# EAGLE design 32u4_Science_Rev_A (EAGLE 6.5.0)
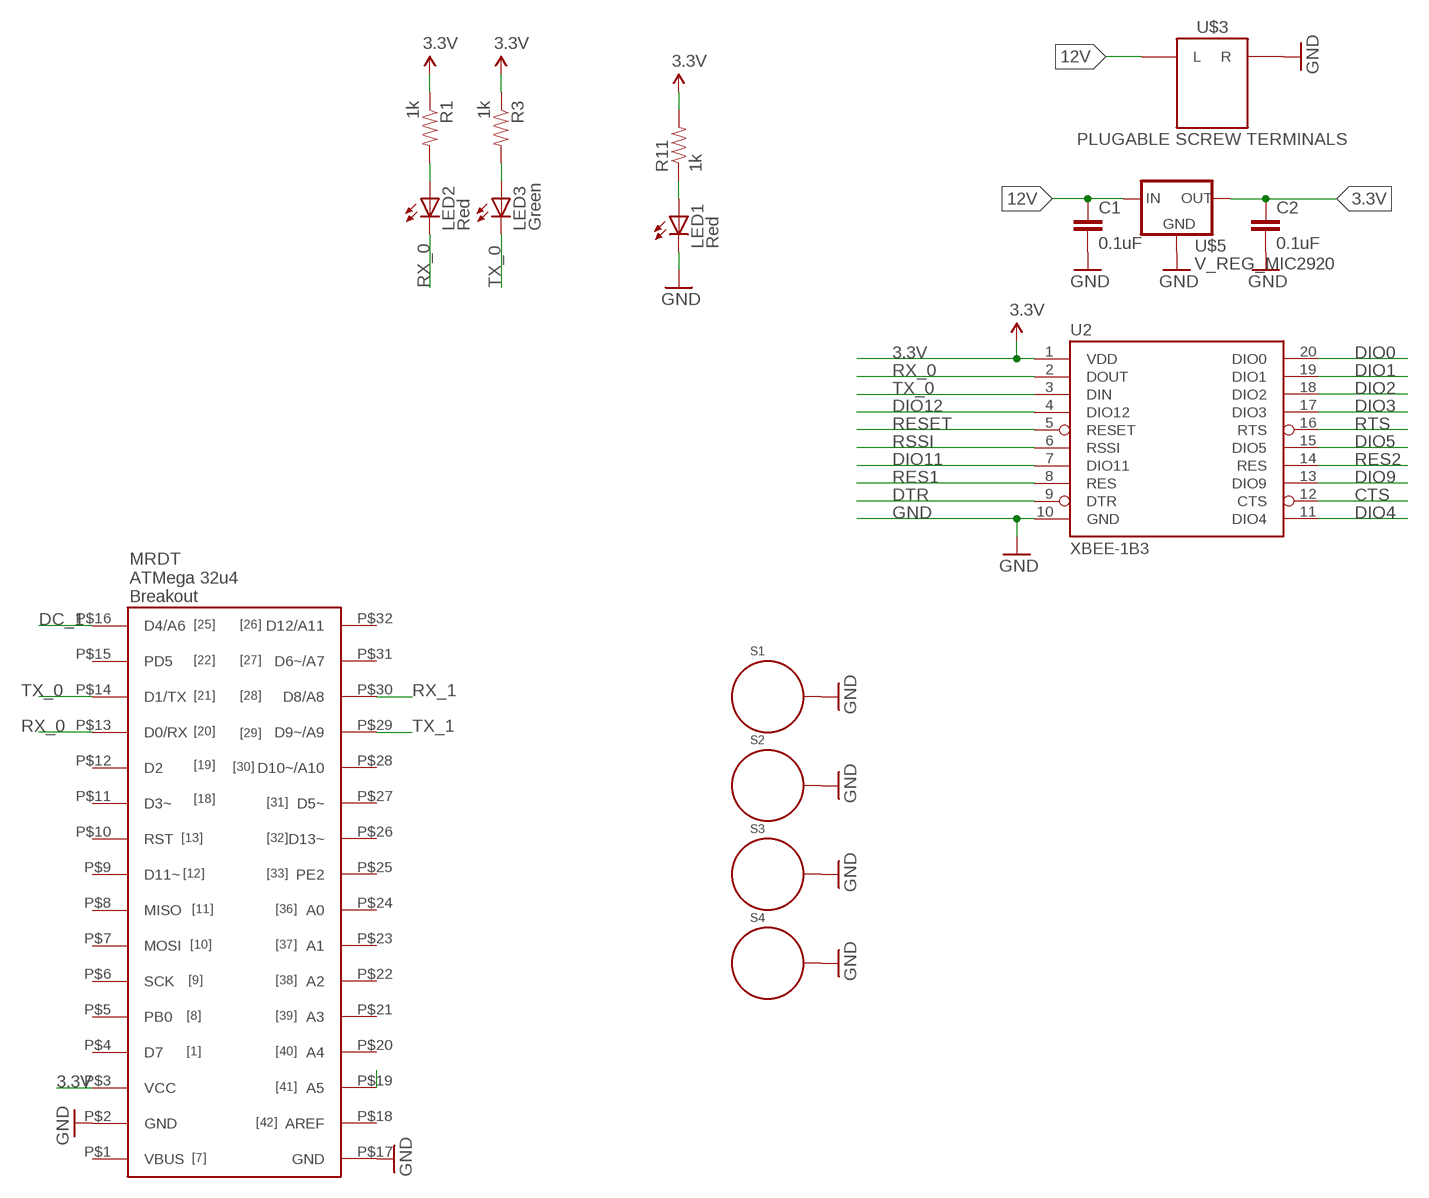
[diagram p0: schematic, sheet 1]

## Parts
C1  0.1uF  CAP1206  [1206]
C2  0.1uF  CAP1206  [1206]
LED1  Red  LED0603  [LED-0603]
LED2  Red  LED0603  [LED-0603]
LED3  Green  LED0603  [LED-0603]
R1  1k  RESISTOR1206  [1206]
R3  1k  RESISTOR1206  [1206]
R11  1k  RESISTOR1206  [1206]
S1  STANDOFF_ELECTRICAL  [STANDOFF-ELECTRICAL]
S2  STANDOFF_ELECTRICAL  [STANDOFF-ELECTRICAL]
S3  STANDOFF_ELECTRICAL  [STANDOFF-ELECTRICAL]
S4  STANDOFF_ELECTRICAL  [STANDOFF-ELECTRICAL]
U2  XBEE-1B3  [XBEE-SMD]
U$1  32U4_BREAKOU_SMD  [32U3_MCU_DIP_SMD]
U$3  PLUGABLE SCREW TERMINALS  H_WR-TBL_3210002VERT  [691321100002]
U$5  V_REG_MIC2920  [SOT223]

## Nets
3.3V [vcc]: C2.1 R1.1 R3.1 R11.2 U2.1(VDD) U$1.P$3(VCC) U$5.3(OUT)
12V: C1.1 U$3.L U$5.1(IN)
CTS: U2.12(CTS)
DC_1: U$1.P$16(D4/A6)
DIO0: U2.20(DIO0)
DIO1: U2.19(DIO1)
DIO2: U2.18(DIO2)
DIO3: U2.17(DIO3)
DIO4: U2.11(DIO4)
DIO5: U2.15(DIO5)
DIO9: U2.13(DIO9)
DIO11: U2.7(DIO11)
DIO12: U2.4(DIO12)
DTR: U2.9(DTR)
GND: C1.2 C2.2 LED1.C S1.P1 S2.P1 S3.P1 S4.P1 U2.10(GND) U$1.P$2(GND) U$1.P$17(GND) U$3.R U$5.2(GND) U$5.4(GND)
N$1: LED2.A R1.2
N$4: LED3.A R3.2
N$11: U$1.P$19(A5)
N$38: LED1.A R11.1
RES1: U2.8(RES)
RES2: U2.14(RES)
RESET: U2.5(RESET)
RSSI: U2.6(RSSI)
RTS: U2.16(RTS)
RX_0: LED2.C U2.2(DOUT) U$1.P$13(D0/RX)
RX_1: U$1.P$30(D8/A8)
TX_0: LED3.C U2.3(DIN) U$1.P$14(D1/TX)
TX_1: U$1.P$29(D9~/A9)
Unconnected: U$1.P$1(VBUS) U$1.P$4(D7) U$1.P$5(PB0) U$1.P$6(SCK) U$1.P$7(MOSI) U$1.P$8(MISO) U$1.P$9(D11~) U$1.P$10(RST) U$1.P$11(D3~) U$1.P$12(D2) U$1.P$15(PD5) U$1.P$18(AREF) U$1.P$20(A4) U$1.P$21(A3) U$1.P$22(A2) U$1.P$23(A1) U$1.P$24(A0) U$1.P$25(PE2) U$1.P$26(D13~) U$1.P$27(D5~) U$1.P$28(D10~/A10) U$1.P$31(D6~/A7) U$1.P$32(D12/A11)

## Library data of the parts
C1 C2 = SparkFun-Passives:CAP: Capacitor Standard 0603 ceramic capacitor, and 0.1" leaded capacitor.
LED1-LED3 = SparkFun:LED: LEDs Standard schematic elements and footprints for 5mm, 3mm, 1206, and 0603 sized LEDs. 5mm - Spark Fun Electronics SKU : COM-00529 (and others)
R1 R3 R11 = SparkFun-Passives:RESISTOR: Resistor Basic schematic elements and footprints for 0603, 1206, and PTH resistors.
S1-S4 = SparkFun-Electromechanical:STANDOFF_ELECTRICAL: A standoff intended to be an electrically connected point. Pad size and stop size allow for a #4 Phillips pan screw head to make a solid connection to the board.
U2 = SparkFun:XBEE-1
U$1 = MRDT-2015-General:32U4_BREAKOU_SMD
U$3 = MRDT-2015-PowerBoard:H_WR-TBL_32*1*0002: Wurth Electronic's 2-pin 10A pluggable screw terminal headers. Vertical and Horizantal Part Numbers: 691322110002 (Horizantal) 691321100002 (Vertical); DIGIKEY_PN: 732-2763-ND
U$5 = SparkFun-PowerIC:V_REG_MIC2920: MIC2920A (http://www.micrel.com/_PDF/mic2920.pdf) - 400mA output LDO Regulator

## Net classes
1 vcc: width 0.305 mm

## Board
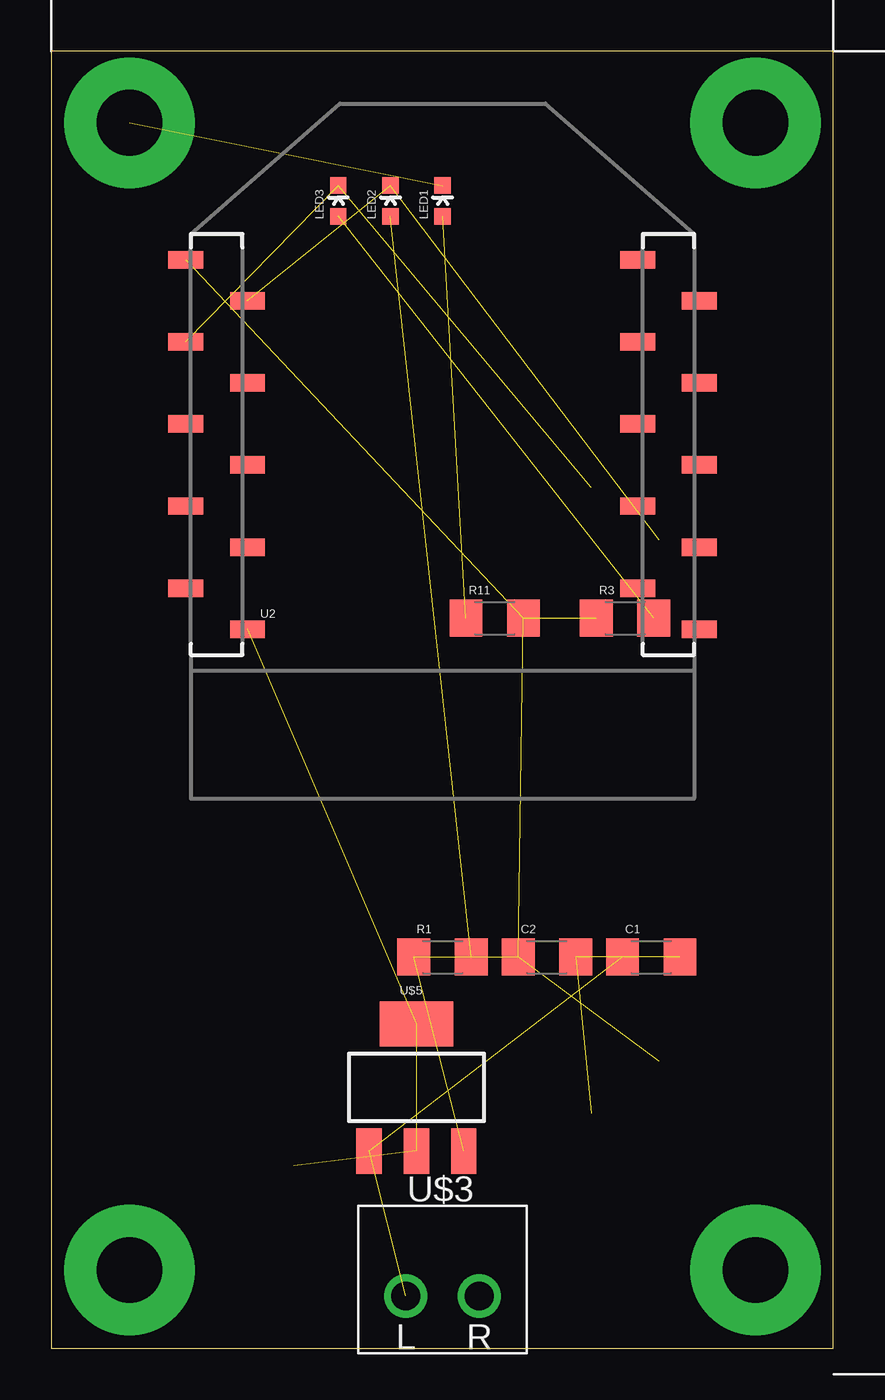
[diagram p1: board, top side]
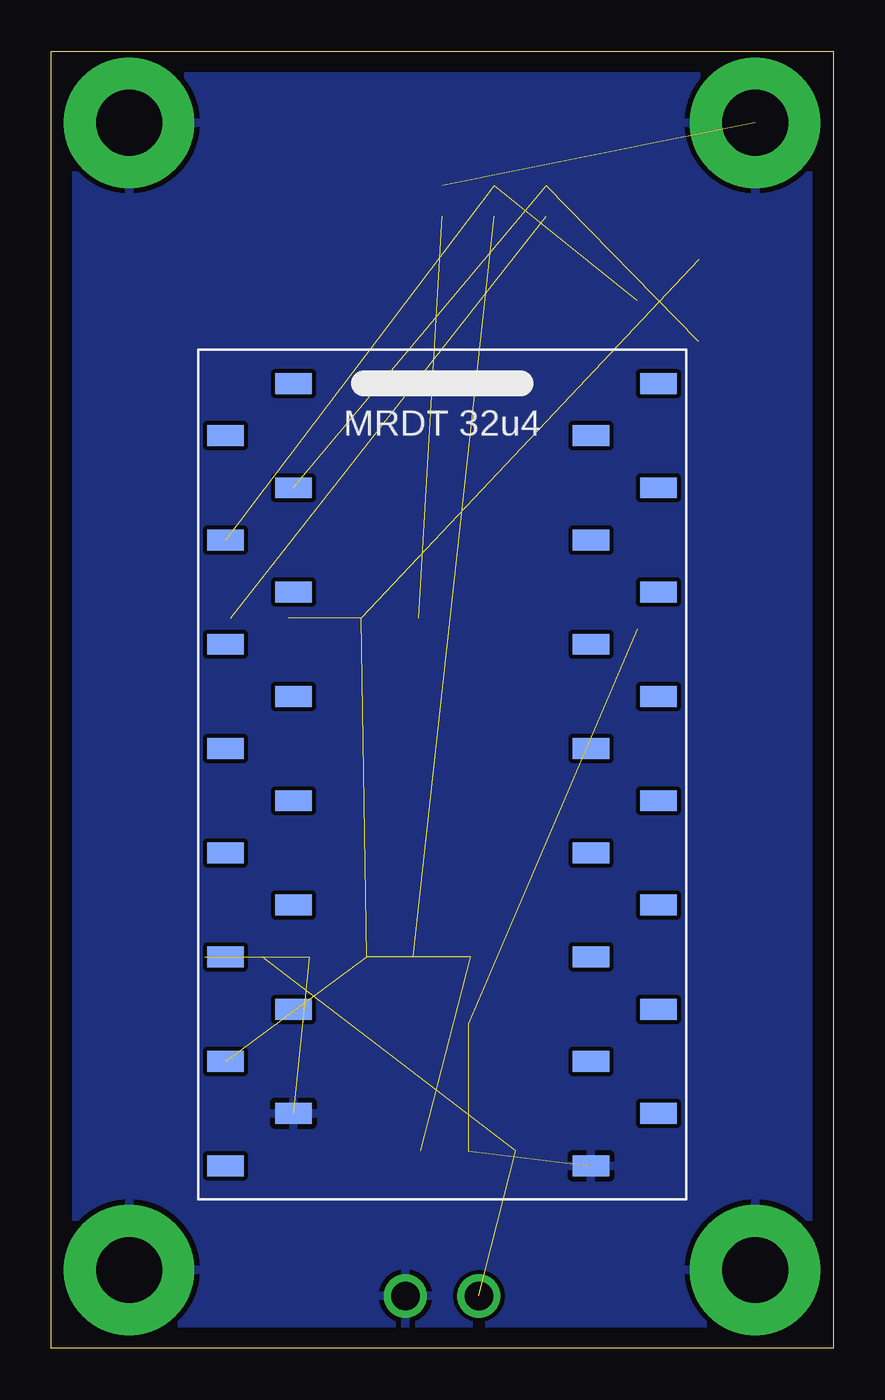
[diagram p2: board, bottom side, seen from below]

Size 38.08 x 63.17 mm. Coordinates in mm from the lower left corner, seen from the top.
Outline: 0,0 38.08,0 38.08,63.17 0,63.17 0,0
Copper layers (1*16): Top 0.035mm / dielectric 1.5mm / Bottom 0.035mm
Design rules "default": minimum track width 10mil, minimum drill 24mil, track to track 8mil, track to pad 8mil, pad to pad 8mil, via to via 8mil, smd to smd 8mil, copper to edge 40mil, drill to drill 8mil, minimum pad ring 10mil, minimum via ring 8mil, stop-mask expansion 4mil, vias tented up to drill 0mil, thermal gap 10mil

### Footprints (pad centres in the part's own frame; a part is rotated, then mirrored left to right if it is on the bottom)
1206 = smd 1.6 x 1.8: 1 -1.4,0; 2 1.4,0
LED-0603 = smd 0.8 x 0.8: A 0,-0.75; C 0,0.75
STANDOFF-ELECTRICAL = drill 3.2 pad 6.35: P1 0,0
XBEE-SMD = smd 1.7 x 0.85: 1 -12.5,20; 2 -9.5,18; 3 -12.5,16; 4 -9.5,14; 5 -12.5,12; 6 -9.5,10; 7 -12.5,8; 8 -9.5,6; 9 -12.5,4; 10 -9.5,2; 11 12.5,2; 12 9.5,4; 13 12.5,6; 14 9.5,8; 15 12.5,10; 16 9.5,12; 17 12.5,14; 18 9.5,16; 19 12.5,18; 20 9.5,20
32U3_MCU_DIP_SMD = smd 1.778 x 1.016: P$1 -10.541,-19.05; P$2 -7.239,-16.51; P$3 -10.541,-13.97; P$4 -7.239,-11.43; P$5 -10.541,-8.89; P$6 -7.239,-6.35; P$7 -10.541,-3.81; P$8 -7.239,-1.27; P$9 -10.541,1.27; P$10 -7.239,3.81; P$11 -10.541,6.35; P$12 -7.239,8.89; P$13 -10.541,11.43; P$14 -7.239,13.97; P$15 -10.541,16.51; P$16 -7.239,19.05; P$17 7.239,-19.05; P$18 10.541,-16.51; P$19 7.239,-13.97; P$20 10.541,-11.43; P$21 7.239,-8.89; P$22 10.541,-6.35; P$23 7.239,-3.81; P$24 10.541,-1.27; P$25 7.239,1.27; P$26 10.541,3.81; P$27 7.239,6.35; P$28 10.541,8.89; P$29 7.239,11.43; P$30 10.541,13.97; P$31 7.239,16.51; P$32 10.541,19.05
691321100002 = drill 1.4: L -1.79,0; R 1.79,0
SOT223 = smd 1.219 x 2.235: 1 -2.311,-3.099; 2 0,-3.099; 3 2.311,-3.099 | smd 3.6 x 2.2: 4 0,3.099

### Placement (x,y rotation side)
C1  29.21,19.05 0 top
C2  24.13,19.05 0 top
LED1  19.05,55.88 0 top
LED2  16.51,55.88 0 top
LED3  13.97,55.88 0 top
R1  19.05,19.05 0 top
R3  27.94,35.56 0 top
R11  21.59,35.56 0 top
S1  34.29,59.69 0 top
S2  34.29,3.81 0 top
S3  3.81,59.69 0 top
S4  3.81,3.81 0 top
U2  19.05,33.02 0 top
U$1  19.05,27.94 0 bottom
U$3  19.05,2.54 0 top
U$5  17.78,12.7 0 top

### Tracks (layer width: path | path; a pad name or v marks a point on that pad's centre or on a via)
3.3V  (6 unrouted)
12V  (2 unrouted)
GND  (6 unrouted)
  pour Bottom: -19.05,72.39 63.5,72.39 63.5,-8.89 -19.05,-8.89
N$1  (1 unrouted)
N$4  (1 unrouted)
N$38  (1 unrouted)
RX_0  (2 unrouted)
TX_0  (2 unrouted)